# Altium schematic sheet HDMI Cable Tester.SchDoc
size A; SheetNumber: 10; SheetTotal: 10
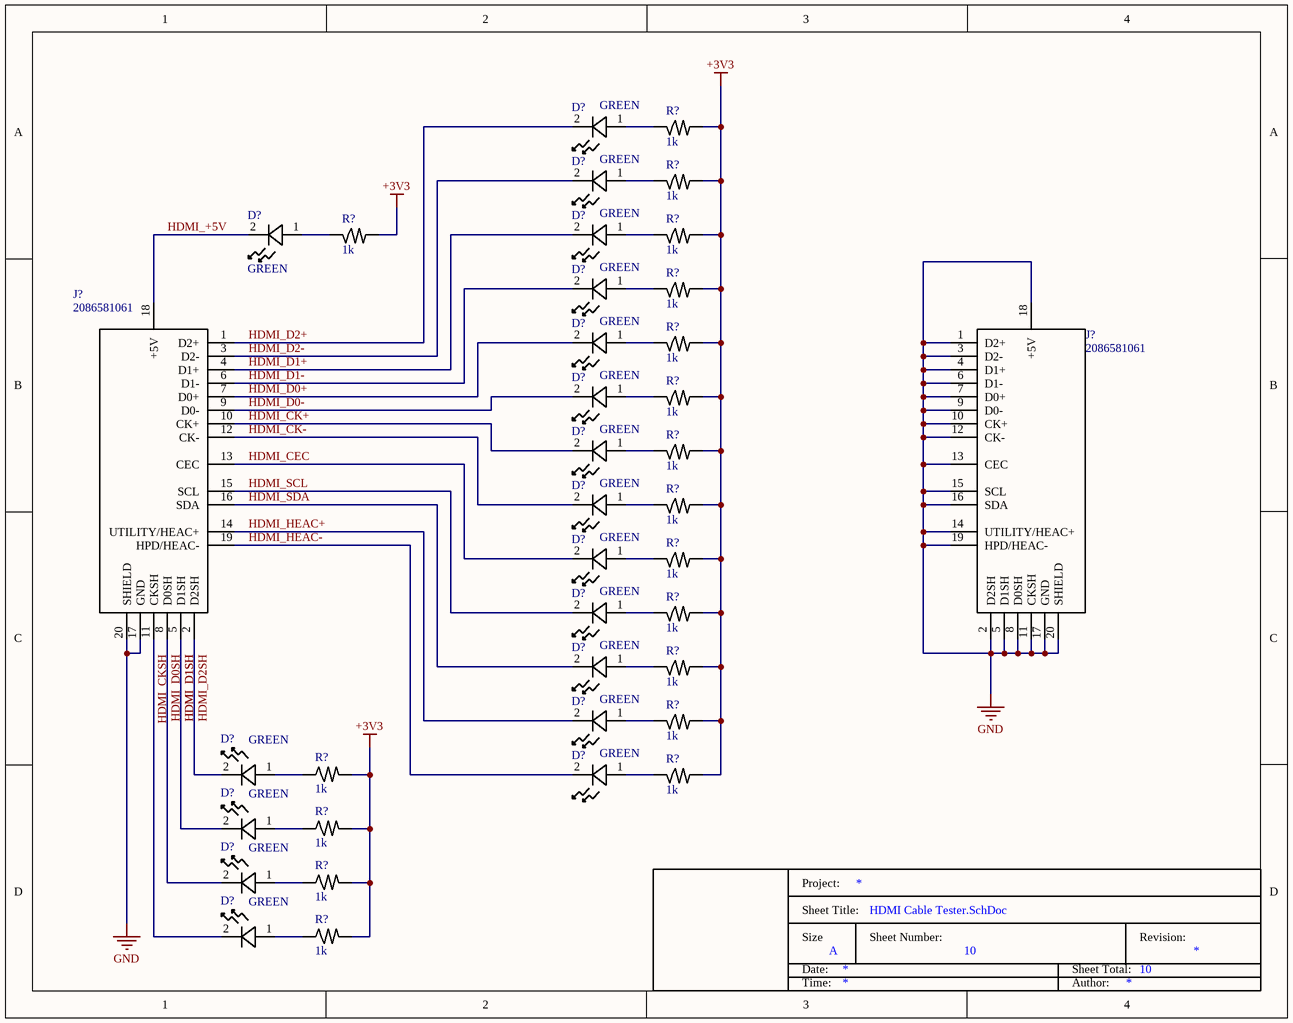
[diagram p0: HDMI Cable Tester.SchDoc]

## Parts
(Parts that share a designator on the sheet are numbered #1, #2 ... from top to bottom, then left to right.)
D?#1  GREEN  [LED0805 GREEN]
D?#2  GREEN  [LED0805 GREEN]
D?#3  GREEN  [LED0805 GREEN]
D?#4  GREEN  [LED0805 GREEN]
D?#5  GREEN  [LED0805 GREEN]
D?#6  GREEN  [LED0805 GREEN]
D?#7  GREEN  [LED0805 GREEN]
D?#8  GREEN  [LED0805 GREEN]
D?#9  GREEN  [LED0805 GREEN]
D?#10  GREEN  [LED0805 GREEN]
D?#11  GREEN  [LED0805 GREEN]
D?#12  GREEN  [LED0805 GREEN]
D?#13  GREEN  [LED0805 GREEN]
D?#14  GREEN  [LED0805 GREEN]
D?#15  GREEN  [LED0805 GREEN]
D?#16  GREEN  [LED0805 GREEN]
D?#17  GREEN  [LED0805 GREEN]
D?#18  GREEN  [LED0805 GREEN]
J?#1  2086581061  [HDMI]
J?#2  2086581061  [HDMI]
R?#1  1k  [R0603]
R?#2  1k  [R0603]
R?#3  1k  [R0603]
R?#4  1k  [R0603]
R?#5  1k  [R0603]
R?#6  1k  [R0603]
R?#7  1k  [R0603]
R?#8  1k  [R0603]
R?#9  1k  [R0603]
R?#10  1k  [R0603]
R?#11  1k  [R0603]
R?#12  1k  [R0603]
R?#13  1k  [R0603]
R?#14  1k  [R0603]
R?#15  1k  [R0603]
R?#16  1k  [R0603]
R?#17  1k  [R0603]
R?#18  1k  [R0603]

## Nets
+3V3: R?#1.1 R?#2.1 R?#3.1 R?#4.1 R?#5.1 R?#6.1 R?#7.1 R?#8.1 R?#9.1 R?#10.1 R?#11.1 R?#12.1 R?#13.1 R?#14.1 R?#15.1 R?#16.1 R?#17.1 R?#18.1
GND: J?#1.17(GND) J?#1.20(SHIELD) J?#2.1(D2+) J?#2.2(D2SH) J?#2.3(D2-) J?#2.4(D1+) J?#2.5(D1SH) J?#2.6(D1-) J?#2.7(D0+) J?#2.8(D0SH) J?#2.9(D0-) J?#2.10(CK+) J?#2.11(CKSH) J?#2.12(CK-) J?#2.13(CEC) J?#2.14(UTILITY/HEAC+) J?#2.15(SCL) J?#2.16(SDA) J?#2.17(GND) J?#2.18(+5V) J?#2.19(HPD/HEAC-) J?#2.20(SHIELD)
HDMI_+5V: D?#3.2 J?#1.18(+5V)
HDMI_CEC: D?#10.2 J?#1.13(CEC)
HDMI_CK+: D?#8.2 J?#1.10(CK+)
HDMI_CK-: D?#9.2 J?#1.12(CK-)
HDMI_CKSH: D?#18.2 J?#1.11(CKSH)
HDMI_D0+: D?#6.2 J?#1.7(D0+)
HDMI_D0-: D?#7.2 J?#1.9(D0-)
HDMI_D0SH: D?#17.2 J?#1.8(D0SH)
HDMI_D1+: D?#4.2 J?#1.4(D1+)
HDMI_D1-: D?#5.2 J?#1.6(D1-)
HDMI_D1SH: D?#16.2 J?#1.5(D1SH)
HDMI_D2+: D?#1.2 J?#1.1(D2+)
HDMI_D2-: D?#2.2 J?#1.3(D2-)
HDMI_D2SH: D?#14.2 J?#1.2(D2SH)
HDMI_HEAC+: D?#13.2 J?#1.14(UTILITY/HEAC+)
HDMI_HEAC-: D?#15.2 J?#1.19(HPD/HEAC-)
HDMI_SCL: D?#11.2 J?#1.15(SCL)
HDMI_SDA: D?#12.2 J?#1.16(SDA)
NetD?#1_1: D?#1.1 R?#1.2
NetD?#2_1: D?#2.1 R?#2.2
NetD?#3_1: D?#3.1 R?#3.2
NetD?#4_1: D?#4.1 R?#4.2
NetD?#5_1: D?#5.1 R?#5.2
NetD?#6_1: D?#6.1 R?#6.2
NetD?#7_1: D?#7.1 R?#7.2
NetD?#8_1: D?#8.1 R?#8.2
NetD?#9_1: D?#9.1 R?#9.2
NetD?#10_1: D?#10.1 R?#10.2
NetD?#11_1: D?#11.1 R?#11.2
NetD?#12_1: D?#12.1 R?#12.2
NetD?#13_1: D?#13.1 R?#13.2
NetD?#14_1: D?#14.1 R?#14.2
NetD?#15_1: D?#15.1 R?#15.2
NetD?#16_1: D?#16.1 R?#16.2
NetD?#17_1: D?#17.1 R?#17.2
NetD?#18_1: D?#18.1 R?#18.2

## Notes on the sheet
- Project:
- Sheet Title:
- Size
- Date:
- A
- Sheet Number:
- Sheet Total:
- Revision:
- Time:
- Author:

## Library data of the parts
D?#1-D?#18 = LED: LED EMERALD GREEN WATER CLEAR 0805 SMD; MF: XINGLIGHT; MP: XL-TD2012UGC; ComponentLink1Description: Datasheet; ComponentLink1URL: https://www.lcsc.com/datasheet/C5349942.pdf; ComponentLink2Description: Supplier1; ComponentLink2URL: https://www.lcsc.com/product-detail/C5349942.html
J?#1 J?#2 = HDMI: CONN RCPT HDMI V2.1 19POS SMD RA; MF: Molex; MP: 2086581061; ComponentLink1Description: Datasheet; ComponentLink1URL: https://www.molex.com/webdocs/datasheets/pdf/en-us/2086581061_IO_CONNECTORS.pdf; ComponentLink2Description: Supplier1; ComponentLink2URL: https://www.digikey.com/en/products/detail/molex/2086581061/10493704
R?#1-R?#18 = Res: RES 1kΩ ±5% 100mW 0603; MF: VO; MP: SCR0603J1K; ComponentLink1Description: Datasheet; ComponentLink1URL: https://www.lcsc.com/datasheet/C3017736.pdf; ComponentLink2Description: Supplier1; ComponentLink2URL: https://www.lcsc.com/product-detail/C3017736.html